# Altium project ChipEMG_Ameliore.PrjPcb
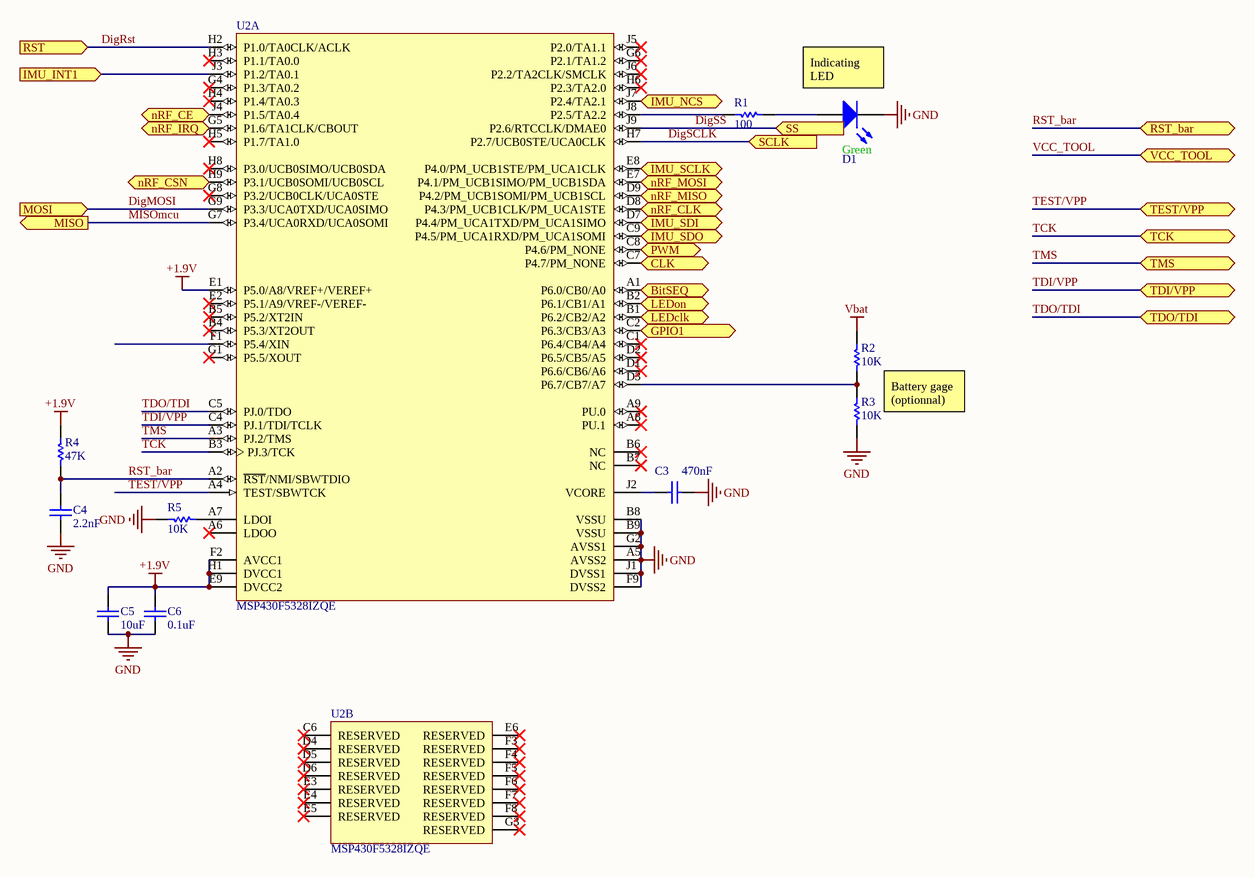
[diagram p0: MCU.SchDoc]
5 sheets, 77 parts. Net scope: flat (ports and power ports of the same name join across sheets).
Board file: ChipEMG_Ameliore.PcbDoc
Sheets:
  MCU.SchDoc
  NRF24L01P.SchDoc
  NewChip.SchDoc
  ICM-20948.SchDoc
  PMU.SchDoc

## Sheet MCU.SchDoc
size Tabloid

### Parts
C3  value 470nF  [0201_Custom]
C4  value 2.2nF  [0201_Custom]
C5  value 10uF  [0402]
C6  value 0.1uF  [0201_Custom]
D1  Color: Green  [0402]
R1  value 100  [0201_Custom]
R2  value 10K  [0201_Custom]
R3  value 10K  [0201_Custom]
R4  value 47K  [0201_Custom]
R5  value 10K  [0201_Custom]
U2  MSP430F5328IZQE  [TI-ZQE80]  (parts A,B of 2)

### Ports
BitSEQ (in), CLK (out), GPIO1 (bidir), IMU_INT1 (in), IMU_NCS (out), IMU_SCLK (in), IMU_SDI (out), IMU_SDO (in), LEDclk (in), LEDon (in), MISO (out), MOSI (in), nRF_CE (out), nRF_CLK (out), nRF_CSN (out), nRF_IRQ (in), nRF_MISO (in), nRF_MOSI (out), PWM (out), RST (in), RST_bar (bidir), SCLK (in), SS (in), TCK (bidir), TDI/VPP (bidir), TDO/TDI (bidir), TEST/VPP (bidir), TMS (bidir), VCC_TOOL (bidir)

### Nets
+1.9V: C5.2 C6.2 R4.1 U2.E1(P5.0/A8/VREF+/VEREF+) U2.E9(DVCC2) U2.F2(AVCC1) U2.H1(DVCC1)
GND: C3.1 C4.2 C5.1 C6.1 D1.2(K) R3.2 R5.2 U2.A5(AVSS2) U2.B8(VSSU) U2.B9(VSSU) U2.F9(DVSS2) U2.G2(AVSS1) U2.J1(DVSS1)  [project net VSSana]
Vbat: R2.1
CLK: U2.C7(P4.7/PM_NONE) ; port CLK
DigMOSI: U2.G9(P3.3/UCA0TXD/UCA0SIMO) ; port MOSI
DigRst: U2.H2(P1.0/TA0CLK/ACLK) ; port RST
DigSCLK: U2.H7(P2.7/UCB0STE/UCA0CLK) ; port SCLK
DigSS: U2.J9(P2.6/RTCCLK/DMAE0) ; port SS
LEDbitSeq: U2.A1(P6.0/CB0/A0) ; port BitSEQ
LEDclk: U2.B1(P6.2/CB2/A2) ; port LEDclk
LEDon: U2.B2(P6.1/CB1/A1) ; port LEDon
LEDpwm: U2.C8(P4.6/PM_NONE) ; port PWM
MISOmcu: U2.G7(P3.4/UCA0RXD/UCA0SOMI) ; port MISO  [project net DigMISO]
RST_bar: C4.1 R4.2 U2.A2(~{RST}/NMI/SBWTDIO) ; port RST_bar
TCK: U2.B3(PJ.3/TCK) ; port TCK
TDI/VPP: U2.C4(PJ.1/TDI/TCLK) ; port TDI/VPP
TDO/TDI: U2.C5(PJ.0/TDO) ; port TDO/TDI
TEST/VPP: U2.A4(TEST/SBWTCK) ; port TEST/VPP
TMS: U2.A3(PJ.2/TMS) ; port TMS
Net*_14: U2.C2(P6.3/CB3/A3) ; port GPIO1
NetC3_2: C3.2 U2.J2(VCORE)
NetD1_1: D1.1(A) R1.1
NetR1_2: R1.2 U2.J8(P2.5/TA2.2)
NetR2_2: R2.2 R3.1 U2.D3(P6.7/CB7/A7)
NetR5_1: R5.1 U2.A7(LDOI)
NetR25_2: U2.D8(P4.3/PM_UCB1CLK/PM_UCA1STE) ; port nRF_CLK
NetU2_C9: U2.C9(P4.5/PM_UCA1RXD/PM_UCA1SOMI) ; port IMU_SDO
NetU2_D7: U2.D7(P4.4/PM_UCA1TXD/PM_UCA1SIMO) ; port IMU_SDI
NetU2_D9: U2.D9(P4.2/PM_UCB1SOMI/PM_UCB1SCL) ; port nRF_MISO
NetU2_E7: U2.E7(P4.1/PM_UCB1SIMO/PM_UCB1SDA) ; port nRF_MOSI
NetU2_E8: U2.E8(P4.0/PM_UCB1STE/PM_UCA1CLK) ; port IMU_SCLK
NetU2_G5: U2.G5(P1.6/TA1CLK/CBOUT) ; port nRF_IRQ
NetU2_H9: U2.H9(P3.1/UCB0SOMI/UCB0SCL) ; port nRF_CSN
NetU2_J3: U2.J3(P1.2/TA0.1) ; port IMU_INT1
NetU2_J4: U2.J4(P1.5/TA0.4) ; port nRF_CE
NetU2_J7: U2.J7(P2.4/TA2.1) ; port IMU_NCS

Not connected (* = marked no-connect by the designer): U2 A6(LDOO)* A8(PU.1)* A9(PU.0)* B4(P5.3/XT2OUT)* B5(P5.2/XT2IN)* B6(NC)* B7(NC)* C1(P6.4/CB4/A4)* C6(RESERVED)* D1(P6.6/CB6/A6)* D2(P6.5/CB5/A5)* D4(RESERVED)* D5(RESERVED)* D6(RESERVED)* E2(P5.1/A9/VREF-/VEREF-)* E3(RESERVED)* E4(RESERVED)* E5(RESERVED)* E6(RESERVED)* F1(P5.4/XIN) F3(RESERVED)* F4(RESERVED)* F5(RESERVED)* F6(RESERVED)* F7(RESERVED)* F8(RESERVED)* G1(P5.5/XOUT)* G3(RESERVED)* G4(P1.3/TA0.2)* G6(P2.1/TA1.2)* G8(P3.2/UCB0CLK/UCA0STE)* H3(P1.1/TA0.0)* H4(P1.4/TA0.3)* H5(P1.7/TA1.0)* H6(P2.3/TA2.0)* H8(P3.0/UCB0SIMO/UCB0SDA)* J5(P2.0/TA1.1)* J6(P2.2/TA2CLK/SMCLK)*

### Notes on the sheet
- (near D1) Indicating LED
- Battery gage (optionnal)

### Library data of the parts
C3-C6 = Cap Semi: Capacitor (Semiconductor SIM Model); Published: 8-Jun-2000; LatestRevisionDate: 29-May-2009; LatestRevisionNote: IPC-7351 Footprint Added.; PackageReference: C1206; Publisher: Altium Limited; PackageDescription: Chip Capacitor
D1 = LED3: Typical BLUE SiC LED; Published: 8-Jun-2000; LatestRevisionDate: 17-Dec-2003; LatestRevisionNote: PCB Footprint replaced.; DatasheetVersion: 16-Apr-2002; PackageVersion: 16-Apr-2002; PackageReference: 3.5X2.8X1.9; Publisher: Altium Limited; PackageDescription: SM LED; 2 C-Bend Leads; Body 3.5 x 2.8 x 1.9 mm, inc leads (LxWxH typ)
R1-R5 = Res Semi: Semiconductor Resistor; Published: 8-Jun-2000; LatestRevisionDate: 17-Jul-2002; LatestRevisionNote: Re-released for DXP Platform.; PackageReference: AXIAL-0.5; Publisher: Altium Limited; PackageDescription: Axial Device, Thru-Hole; 2 Leads; 0.5 in Pin Spacing
U2 = MSP430F5328IZQE: 25 MHz Mixed Signal Microcontroller with 128 KB Flash, 10240 B SRAM and 48 GPIOs, -40 to 85 degC, 80-pin BGA (ZQE), Green (RoHS & no Sb/Br); Manufacturer: Texas Instruments; ADC: 12-bit SAR; ADC Channels: 16; Brown Out Reset: Yes; DMA: 3; Flash(KB): 128; Frequency(MHz): 25; GPIO: 48; Multiplier: 32x32; SRAM(B): 10240; SubFamily: 5 Series; Timers - 16-bit: 4; USCI_A (UART/LIN/IrDA/SPI): 2; DatasheetVersion: SLAS678C; PackageVersion: 4204334-6/G; PackageReference: ZQE80; PackageDescription: 80-Pin Plastic Ball Grid Array, Body 5 x 5 mm, Pitch 0.5 mm; Supplier 1: Digi-Key; Supplier Part Number 1: 296-30060-2-ND; Supplier 2: Digi-Key; Supplier Part Number 2: 296-30060-1-ND; Supplier 3: Digi-Key; Supplier Part Number 3: 296-30060-6-ND; Supplier 4: Farnell; Supplier Part Number 4: 2072181; Supplier 5: Newark; Supplier Part Number 5: 74T4608; Supplier 6: Newark; Supplier Part Number 6: 76T0384; Supplier 7: Mouser; Supplier Part Number 7: 595-MSP430F5328IRGCT; Comparators: Yes; Eco-Plan: Green (RoHS & no Sb/Br); Real-Time Clock: Yes; SVS: Yes; Temp Sensor: Yes; USCI_B (I2C & SPI): 2; Watchdog: Yes; Mounting Technology: Surface Mount; Code_JEDEC: MO-225; PartNumber: MSP430F5328IZQE; ComponentLink1Description: Manufacturer URL; ComponentLink1URL: http://www.ti.com/; ComponentLink2Description: Datasheet; ComponentLink2URL: http://www.ti.com/general/docs/lit/getliterature.tsp?genericPartNumber=MSP430F5328&fileType=pdf; ComponentLink3Description: Package Specification; ComponentLink3URL: http://www.ti.com/litv/pdf/mpbg269e

## Sheet NRF24L01P.SchDoc
size Tabloid
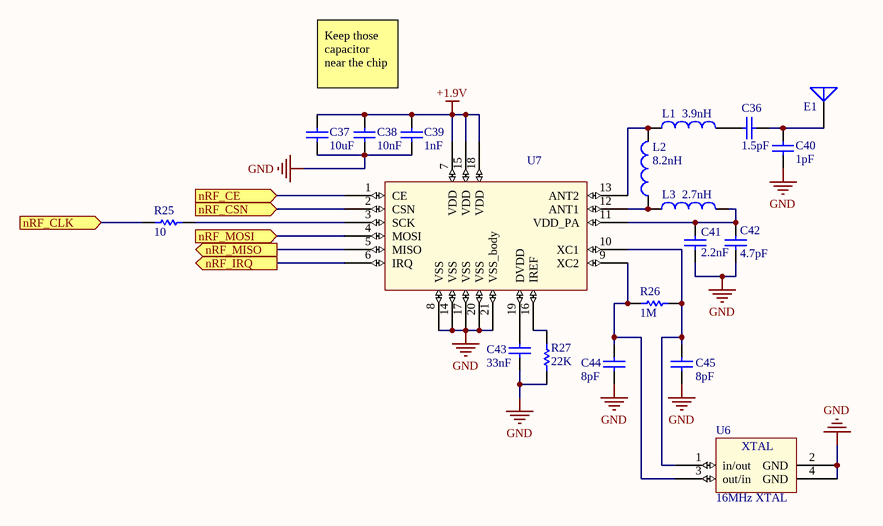
[diagram p1: NRF24L01P.SchDoc]

### Parts
C36  value 1.5pF  [0201_Custom]
C37  value 10uF  [0402]
C38  value 10nF  [0201_Custom]
C39  value 1nF  [0201_Custom]
C40  value 1pF  [0201_Custom]
C41  value 2.2nF  [0201_Custom]
C42  value 4.7pF  [0201_Custom]
C43  value 33nF  [0201_Custom]
C44  value 8pF  [0201_Custom]
C45  value 8pF  [0201_Custom]
E1  (no value)  [ANT-2.45-CHP-B]
L1  value 3.9nH  [0201_Custom]
L2  value 8.2nH  [0201_Custom]
L3  value 2.7nH  [0201_Custom]
R25  value 10  [0201_Custom]
R26  value 1M  [0201_Custom]
R27  value 22K  [0201_Custom]
U6  16MHz XTAL  [8Y-16.000MAAV-T]
U7  (no value)  [QFN50P400X400-20W5M]

### Ports
nRF_CE (in), nRF_CLK (in), nRF_CSN (in), nRF_IRQ (out), nRF_MISO (out), nRF_MOSI (in)

### Nets
+1.9V: C37.2 C38.2 C39.2 U7.7(VDD) U7.15(VDD) U7.18(VDD)
GND: C37.1 C38.1 C39.1 C40.2 C41.1 C42.1 C43.1 C44.1 C45.1 R27.1 U6.2(GND) U6.4(GND) U7.8(VSS) U7.14(VSS) U7.17(VSS) U7.20(VSS) U7.21(VSS_body)  [project net VSSana]
NetC36_1: C36.1 C40.1 E1.1(A)
NetC36_2: C36.2 L1.2
NetC41_2: C41.2 C42.2 L3.2 U7.11(VDD_PA)
NetC43_2: C43.2 U7.19(DVDD)
NetC44_2: C44.2 R26.2 U6.3(out/in) U7.9(XC2)
NetC45_2: C45.2 R26.1 U6.1(in/out) U7.10(XC1)
NetL1_1: L1.1 L2.2 U7.13(ANT2)
NetL2_1: L2.1 L3.1 U7.12(ANT1)
NetR25_1: R25.1 U7.3(SCK)
NetR25_2: R25.2 ; port nRF_CLK
NetR27_2: R27.2 U7.16(IREF)
NetU2_D9: U7.5(MISO) ; port nRF_MISO
NetU2_E7: U7.4(MOSI) ; port nRF_MOSI
NetU2_G5: U7.6(IRQ) ; port nRF_IRQ
NetU2_H9: U7.2(CSN) ; port nRF_CSN
NetU2_J4: U7.1(CE) ; port nRF_CE

### Notes on the sheet
- Keep those capacitor near the chip
- (in symbol 8Y-16.000MAAV-T) XTAL

### Library data of the parts
C36-C45 = Cap Semi: Capacitor (Semiconductor SIM Model); Published: 8-Jun-2000; LatestRevisionDate: 29-May-2009; LatestRevisionNote: IPC-7351 Footprint Added.; PackageReference: C1206; Publisher: Altium Limited; PackageDescription: Chip Capacitor
E1 = Antenna: Generic Antenna; Published: 24-Mar-1999; LatestRevisionDate: 17-Jul-2002; LatestRevisionNote: Re-released for DXP Platform.; PackageReference: PIN1; Publisher: Altium Limited
L1-L3 = Inductor: Code_IEC: 1005; Published: 8-Jun-2000; LatestRevisionDate: 29-May-2009; LatestRevisionNote: IPC-7351 Footprint Added.; PackageReference: 0402-A; Publisher: Altium Limited; PackageDescription: Chip Inductor; Code_JEITA: 0402
R25-R27 = Res Semi: Semiconductor Resistor; Published: 8-Jun-2000; LatestRevisionDate: 17-Jul-2002; LatestRevisionNote: Re-released for DXP Platform.; PackageReference: AXIAL-0.5; Publisher: Altium Limited; PackageDescription: Axial Device, Thru-Hole; 2 Leads; 0.5 in Pin Spacing
U6 = 8Y-16.000MAAV-T: SMD 16 MHz XTAL
U7 = nRF24L01p: nRF24L01+

## Sheet NewChip.SchDoc
size Tabloid
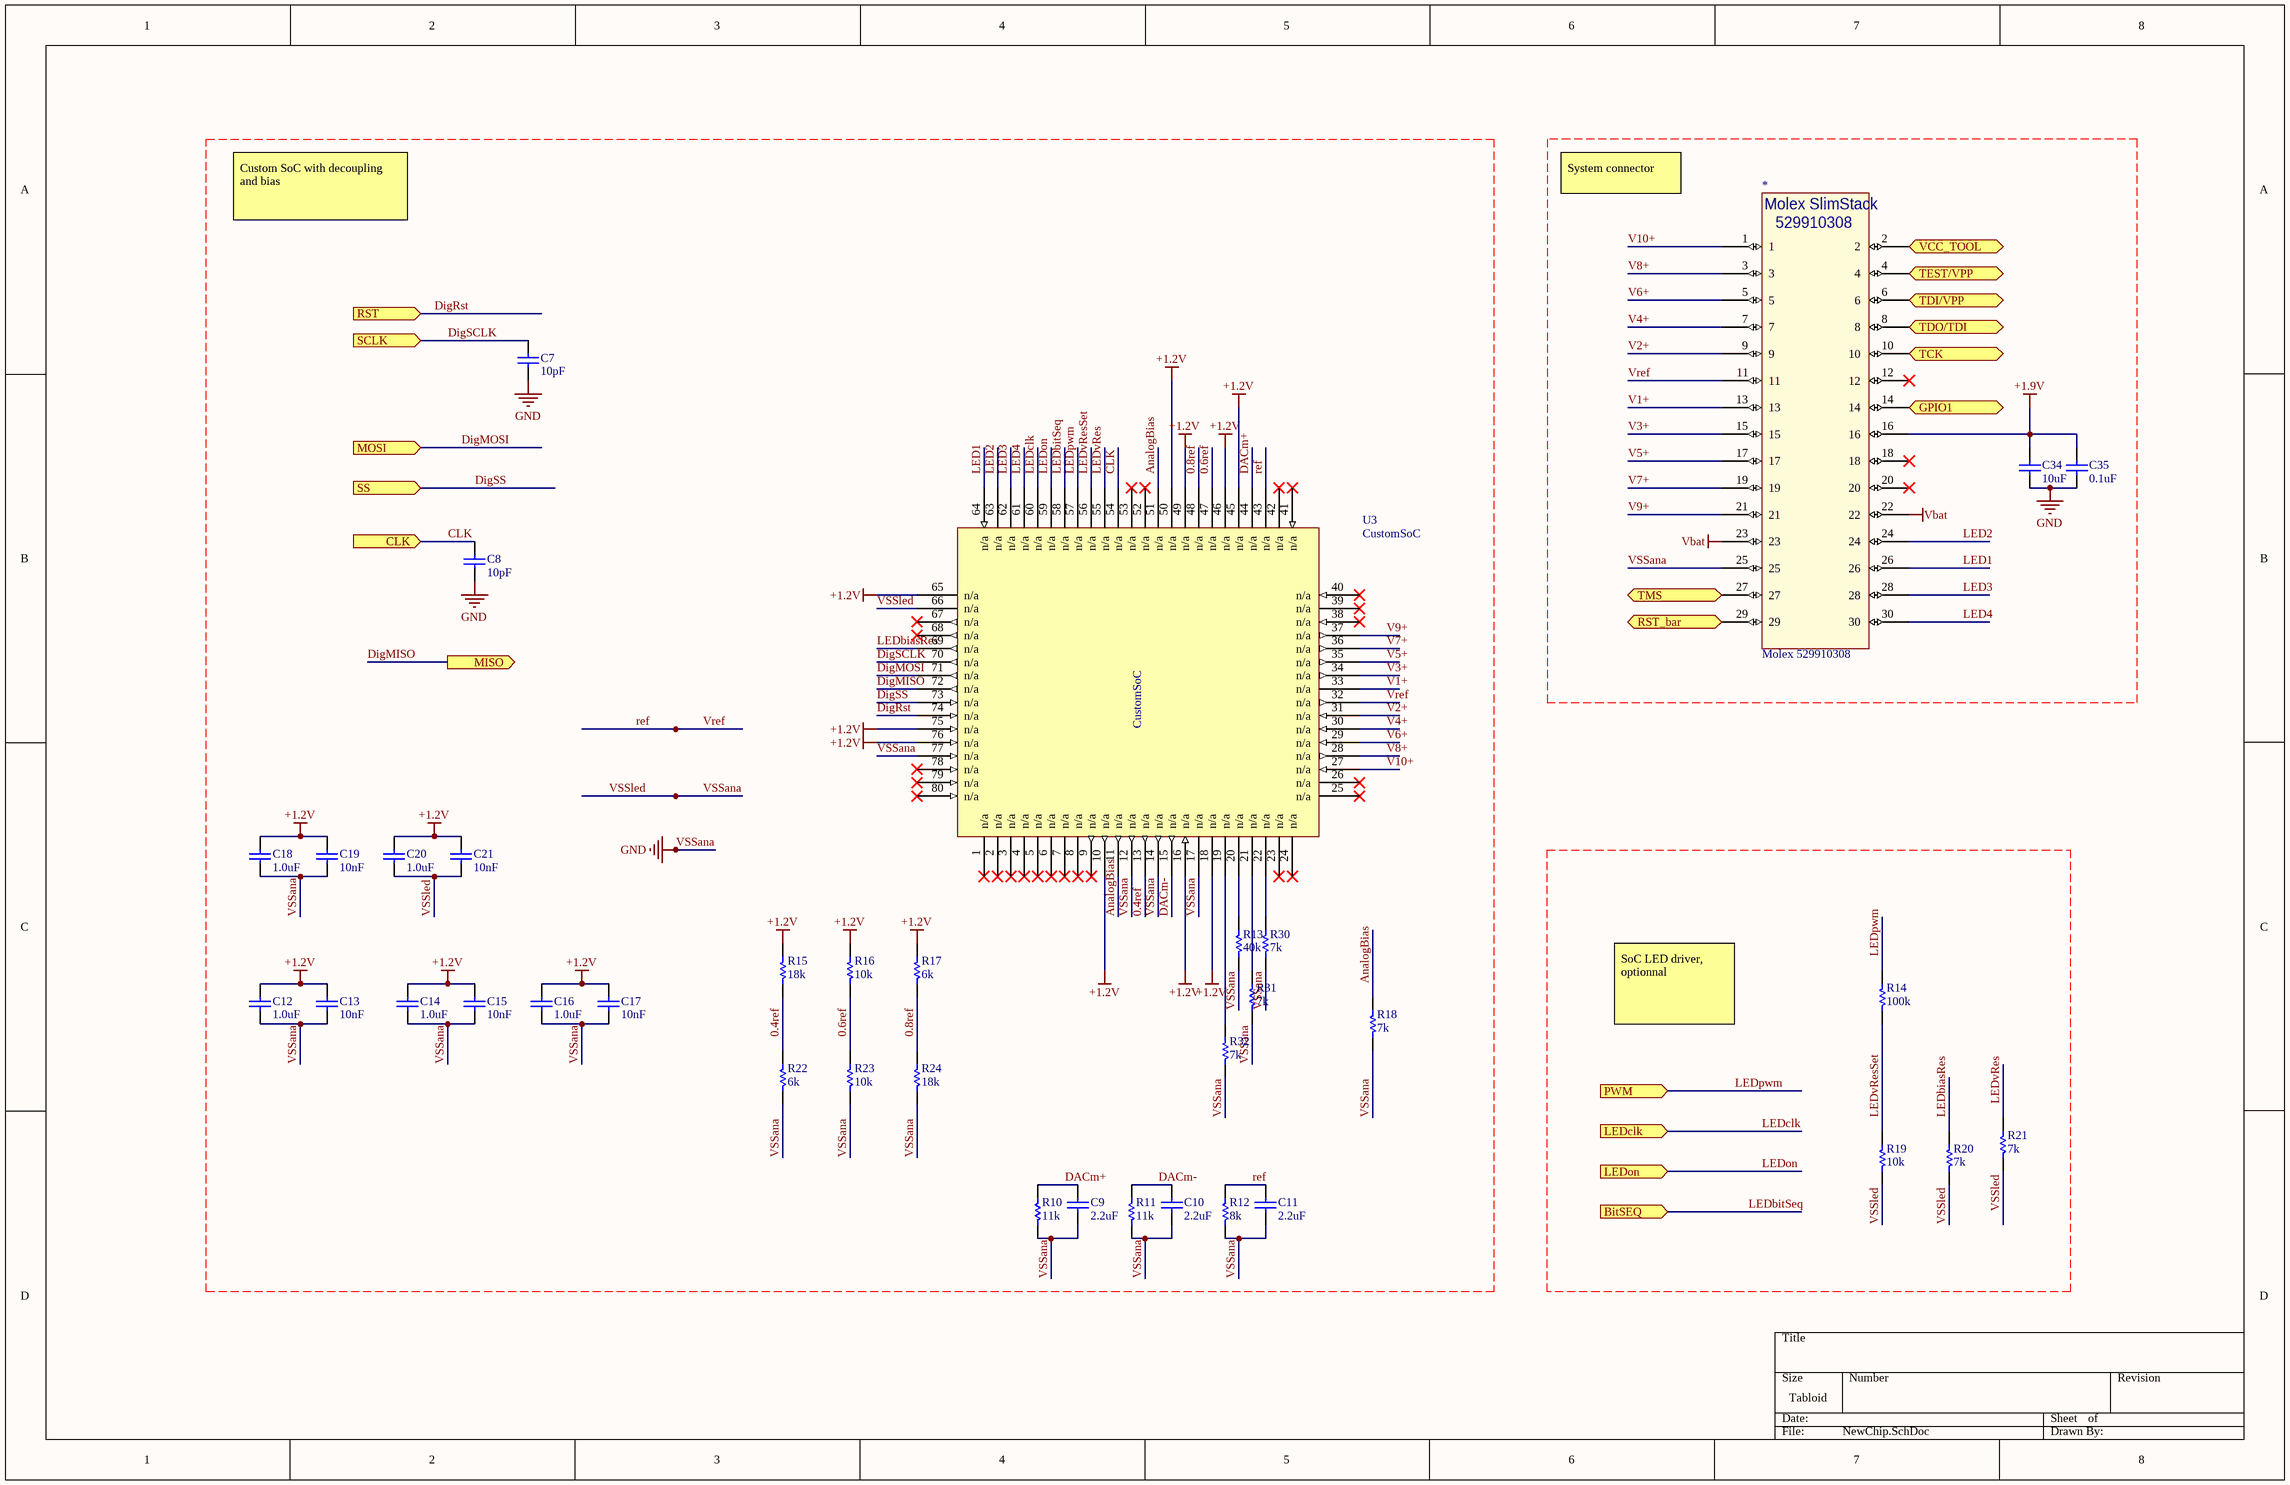
[diagram p2: NewChip.SchDoc]

### Parts
*  Molex 529910308  [Molex 0529910308]
C7  value 10pF  [0201_Custom]
C8  value 10pF  [0201_Custom]
C9  value 2.2uF  [0201_Custom]
C10  value 2.2uF  [0201_Custom]
C11  value 2.2uF  [0201_Custom]
C12  value 1.0uF  [0201_Custom]
C13  value 10nF  [0201_Custom]
C14  value 1.0uF  [0201_Custom]
C15  value 10nF  [0201_Custom]
C16  value 1.0uF  [0201_Custom]
C17  value 10nF  [0201_Custom]
C18  value 1.0uF  [0201_Custom]
C19  value 10nF  [0201_Custom]
C20  value 1.0uF  [0201_Custom]
C21  value 10nF  [0201_Custom]
C34  value 10uF  [0402]
C35  value 0.1uF  [0201_Custom]
R10  value 11k  [0201_Custom]
R11  value 11k  [0201_Custom]
R12  value 8k  [0201_Custom]
R13  value 40k  [0201_Custom]
R14  value 100k  [0201_Custom]
R15  value 18k  [0201_Custom]
R16  value 10k  [0201_Custom]
R17  value 6k  [0201_Custom]
R18  value 7k  [0201_Custom]
R19  value 10k  [0201_Custom]
R20  value 7k  [0201_Custom]
R21  value 7k  [0201_Custom]
R22  value 6k  [0201_Custom]
R23  value 10k  [0201_Custom]
R24  value 18k  [0201_Custom]
R30  value 7k  [0201_Custom]
R31  value 7k  [0201_Custom]
R32  value 7k  [0201_Custom]
U3  CustomSoC  [CustomSoC]

### Ports
BitSEQ (in), CLK (in), GPIO1 (bidir), LEDclk (in), LEDon (in), MISO (out), MOSI (in), PWM (in), RST (in), RST_bar (bidir), SCLK (in), SS (in), TCK (bidir), TDI/VPP (bidir), TDO/TDI (bidir), TEST/VPP (bidir), TMS (bidir), VCC_TOOL (bidir)

### Nets
+1.2V: C12.1 C13.1 C14.1 C15.1 C16.1 C17.1 C18.1 C19.1 C20.1 C21.1 R15.1 R16.1 R17.1 U3.10(n/a) U3.16(n/a) U3.18(n/a) U3.45(n/a) U3.46(n/a) U3.49(n/a) U3.50(n/a) U3.65(n/a) U3.75(n/a) U3.76(n/a)
+1.9V: *.16 C34.2 C35.2
Vbat: *.22 *.23
VSSana: *.25 C7.2 C8.2 C9.2 C10.2 C11.2 C12.2 C13.2 C14.2 C15.2 C16.2 C17.2 C18.2 C19.2 C20.2 C21.2 C34.1 C35.1 R10.2 R11.2 R12.2 R13.2 R18.2 R19.2 R20.2 R21.2 R22.2 R23.2 R24.2 R30.2 R31.2 R32.2 U3.12(n/a) U3.14(n/a) U3.17(n/a) U3.66(n/a) U3.77(n/a)  [also labelled GND, VSSled]
0.4ref: R15.2 R22.1 U3.13(n/a)
0.6ref: R16.2 R23.1 U3.47(n/a)
0.8ref: R17.2 R24.1 U3.48(n/a)
AnalogBias: R18.1 U3.11(n/a) U3.51(n/a)
CLK: C8.1 U3.54(n/a) ; port CLK
DACm+: C9.1 R10.1 U3.44(n/a)
DACm-: C10.1 R11.1 U3.15(n/a)
DigMISO: U3.72(n/a) ; port MISO
DigMOSI: U3.71(n/a) ; port MOSI
DigRst: U3.74(n/a) ; port RST
DigSCLK: C7.1 U3.70(n/a) ; port SCLK
DigSS: U3.73(n/a) ; port SS
LED1: *.26 U3.64(n/a)
LED2: *.24 U3.63(n/a)
LED3: *.28 U3.62(n/a)
LED4: *.30 U3.61(n/a)
LEDbiasRes: R20.1 U3.69(n/a)
LEDbitSeq: U3.58(n/a) ; port BitSEQ
LEDclk: U3.60(n/a) ; port LEDclk
LEDon: U3.59(n/a) ; port LEDon
LEDpwm: R14.1 U3.57(n/a) ; port PWM
LEDvRes: R21.1 U3.55(n/a)
LEDvResSet: R14.2 R19.1 U3.56(n/a)
ref: *.11 C11.1 R12.1 U3.32(n/a) U3.43(n/a)  [also labelled Vref]
RST_bar: *.29 ; port RST_bar
TCK: *.10 ; port TCK
TDI/VPP: *.6 ; port TDI/VPP
TDO/TDI: *.8 ; port TDO/TDI
TEST/VPP: *.4 ; port TEST/VPP
TMS: *.27 ; port TMS
V1+: *.13 U3.33(n/a)
V2+: *.9 U3.31(n/a)
V3+: *.15 U3.34(n/a)
V4+: *.7 U3.30(n/a)
V5+: *.17 U3.35(n/a)
V6+: *.5 U3.29(n/a)
V7+: *.19 U3.36(n/a)
V8+: *.3 U3.28(n/a)
V9+: *.21 U3.37(n/a)
V10+: *.1 U3.27(n/a)
VCC_TOOL: *.2 ; port VCC_TOOL
Net*_14: *.14 ; port GPIO1
NetR13_1: R13.1 U3.20(n/a)
NetR30_1: R30.1 U3.22(n/a)
NetR31_1: R31.1 U3.21(n/a)
NetR32_1: R32.1 U3.19(n/a)

Not connected (* = marked no-connect by the designer): * 12* 18* 20*; U3 1(n/a)* 2(n/a)* 3(n/a)* 4(n/a)* 5(n/a)* 6(n/a)* 7(n/a)* 8(n/a)* 9(n/a)* 23(n/a)* 24(n/a)* 25(n/a)* 26(n/a)* 38(n/a)* 39(n/a)* 40(n/a)* 41(n/a)* 42(n/a)* 52(n/a)* 53(n/a)* 67(n/a)* 68(n/a)* 78(n/a)* 79(n/a)* 80(n/a)*

### Notes on the sheet
- Custom SoC with decoupling and bias
- System connector
- SoC LED driver, optionnal
- (in symbol Molex 529910308) Molex SlimStack; 529910308

### Library data of the parts
C7-C21 C34 C35 = Cap Semi: Capacitor (Semiconductor SIM Model); Published: 8-Jun-2000; LatestRevisionDate: 29-May-2009; LatestRevisionNote: IPC-7351 Footprint Added.; PackageReference: C1206; Publisher: Altium Limited; PackageDescription: Chip Capacitor
R10-R24 R30-R32 = Res Semi: Semiconductor Resistor; Published: 8-Jun-2000; LatestRevisionDate: 17-Jul-2002; LatestRevisionNote: Re-released for DXP Platform.; PackageReference: AXIAL-0.5; Publisher: Altium Limited; PackageDescription: Axial Device, Thru-Hole; 2 Leads; 0.5 in Pin Spacing

## Sheet ICM-20948.SchDoc
size A4
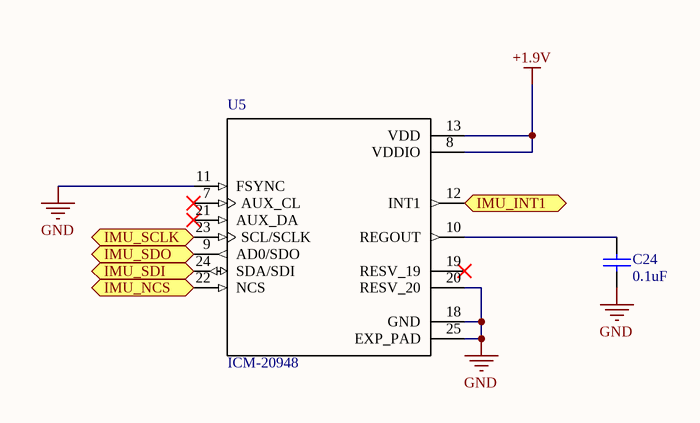
[diagram p3: ICM-20948.SchDoc]

### Parts
C24  value 0.1uF  [0201_Custom]
U5  ICM-20948  [ICM-20948]

### Ports
IMU_INT1 (out), IMU_NCS (in), IMU_SCLK (in), IMU_SDI (in), IMU_SDO (out)

### Nets
+1.9V: U5.8(VDDIO) U5.13(VDD)
GND: C24.2 U5.11(FSYNC) U5.18(GND) U5.20(RESV_20) U5.25(EXP_PAD)  [project net VSSana]
NetC24_1: C24.1 U5.10(REGOUT)
NetU2_C9: U5.9(AD0/SDO) ; port IMU_SDO
NetU2_D7: U5.24(SDA/SDI) ; port IMU_SDI
NetU2_E8: U5.23(SCL/SCLK) ; port IMU_SCLK
NetU2_J3: U5.12(INT1) ; port IMU_INT1
NetU2_J7: U5.22(NCS) ; port IMU_NCS

Not connected (* = marked no-connect by the designer): U5 7(AUX_CL)* 19(RESV_19)* 21(AUX_DA)*

### Library data of the parts
C24 = Cap Semi: Capacitor (Semiconductor SIM Model); Published: 8-Jun-2000; LatestRevisionDate: 29-May-2009; LatestRevisionNote: IPC-7351 Footprint Added.; PackageReference: C1206; Publisher: Altium Limited; PackageDescription: Chip Capacitor
U5 = ICM-20948: 9 Axis=3 Axis Gyro+3 Axis Accel+Compass. Pin For Pin With m; MF: TDK InvenSense; MP: ICM-20948; SnapEDA_Link: https://www.snapeda.com/parts/ICM-20948/TDK%20InvenSense/view-part/?ref=snap; Package: QFN-24 InvenSense; Digi-Key_Part_Number: 1428-1123-1-ND; Digi-Key_Purchase_URL: https://www.digikey.ca/product-detail/en/tdk-invensense/ICM-20948/1428-1123-1-ND/7062698?utm_source=snapeda&utm_medium=aggregator&utm_campaign=symbol; Value: *

## Sheet PMU.SchDoc
size A4
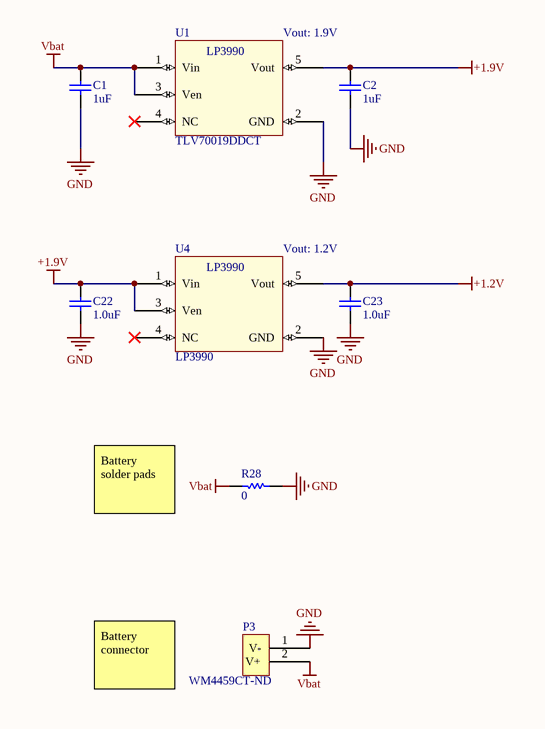
[diagram p4: PMU.SchDoc]

### Parts
C1  value 1uF  [0402]
C2  value 1uF  [0402]
C22  value 1.0uF  [0201_Custom]
C23  value 1.0uF  [0201_Custom]
P3  WM4459CT-ND  [WM4459CT-ND_Footprint]
R28  value 0  [1608[0603]]
U1  TLV70019DDCT  Vout: 1.9V  [SOT23-5Metric]
U4  LP3990  Vout: 1.2V  [SOT23-5Metric]

### Nets
+1.2V: C23.1 U4.5(Vout)
+1.9V: C2.2 C22.1 U1.5(Vout) U4.1(Vin) U4.3(Ven)
GND: C1.1 C2.1 C22.2 C23.2 P3.1(V-) R28.1 U1.2(GND) U4.2(GND)  [project net VSSana]
Vbat: C1.2 P3.2(V+) R28.2 U1.1(Vin) U1.3(Ven)

Not connected (* = marked no-connect by the designer): U1 4(NC)*; U4 4(NC)*

### Notes on the sheet
- Battery solder pads
- Battery connector

### Library data of the parts
C1 C2 C22 C23 = Cap Semi: Capacitor (Semiconductor SIM Model); Published: 8-Jun-2000; LatestRevisionDate: 29-May-2009; LatestRevisionNote: IPC-7351 Footprint Added.; PackageReference: C1206; Publisher: Altium Limited; PackageDescription: Chip Capacitor
P3 = WM4459CT-ND: 1.20MM WTB RECEPT CONNECTOR
R28 = Res Semi: Semiconductor Resistor; Published: 8-Jun-2000; LatestRevisionDate: 17-Jul-2002; LatestRevisionNote: Re-released for DXP Platform.; PackageReference: AXIAL-0.5; Publisher: Altium Limited; PackageDescription: Axial Device, Thru-Hole; 2 Leads; 0.5 in Pin Spacing
U1 U4 = LP3990: 150mA Linear Voltage Regulator for Digital Applications; Package: SOT-23

## Nets that join several sheets
+1.2V: NewChip (23 pins), PMU (C23.1 U4.5)
+1.9V: MCU (7 pins), NRF24L01P (6 pins), NewChip (*.16 C34.2 C35.2), ICM-20948 (U5.8 U5.13), PMU (5 pins)
Vbat: MCU (R2.1), NewChip (*.22 *.23), PMU (5 pins)
VSSana: MCU (13 pins), NRF24L01P (17 pins), NewChip (37 pins), ICM-20948 (5 pins), PMU (8 pins)
CLK: MCU (U2.C7), NewChip (C8.1 U3.54)
DigMISO: MCU (U2.G7), NewChip (U3.72)
DigMOSI: MCU (U2.G9), NewChip (U3.71)
DigRst: MCU (U2.H2), NewChip (U3.74)
DigSCLK: MCU (U2.H7), NewChip (C7.1 U3.70)
DigSS: MCU (U2.J9), NewChip (U3.73)
LEDbitSeq: MCU (U2.A1), NewChip (U3.58)
LEDclk: MCU (U2.B1), NewChip (U3.60)
LEDon: MCU (U2.B2), NewChip (U3.59)
LEDpwm: MCU (U2.C8), NewChip (R14.1 U3.57)
Net*_14: MCU (U2.C2), NewChip (*.14)
NetR25_2: MCU (U2.D8), NRF24L01P (R25.2)
NetU2_C9: MCU (U2.C9), ICM-20948 (U5.9)
NetU2_D7: MCU (U2.D7), ICM-20948 (U5.24)
NetU2_D9: MCU (U2.D9), NRF24L01P (U7.5)
NetU2_E7: MCU (U2.E7), NRF24L01P (U7.4)
NetU2_E8: MCU (U2.E8), ICM-20948 (U5.23)
NetU2_G5: MCU (U2.G5), NRF24L01P (U7.6)
NetU2_H9: MCU (U2.H9), NRF24L01P (U7.2)
NetU2_J3: MCU (U2.J3), ICM-20948 (U5.12)
NetU2_J4: MCU (U2.J4), NRF24L01P (U7.1)
NetU2_J7: MCU (U2.J7), ICM-20948 (U5.22)
RST_bar: MCU (C4.1 R4.2 U2.A2), NewChip (*.29)
TCK: MCU (U2.B3), NewChip (*.10)
TDI/VPP: MCU (U2.C4), NewChip (*.6)
TDO/TDI: MCU (U2.C5), NewChip (*.8)
TEST/VPP: MCU (U2.A4), NewChip (*.4)
TMS: MCU (U2.A3), NewChip (*.27)